# Altium project Stm32l433rct6 Geliştirme Kartı.PrjPcb
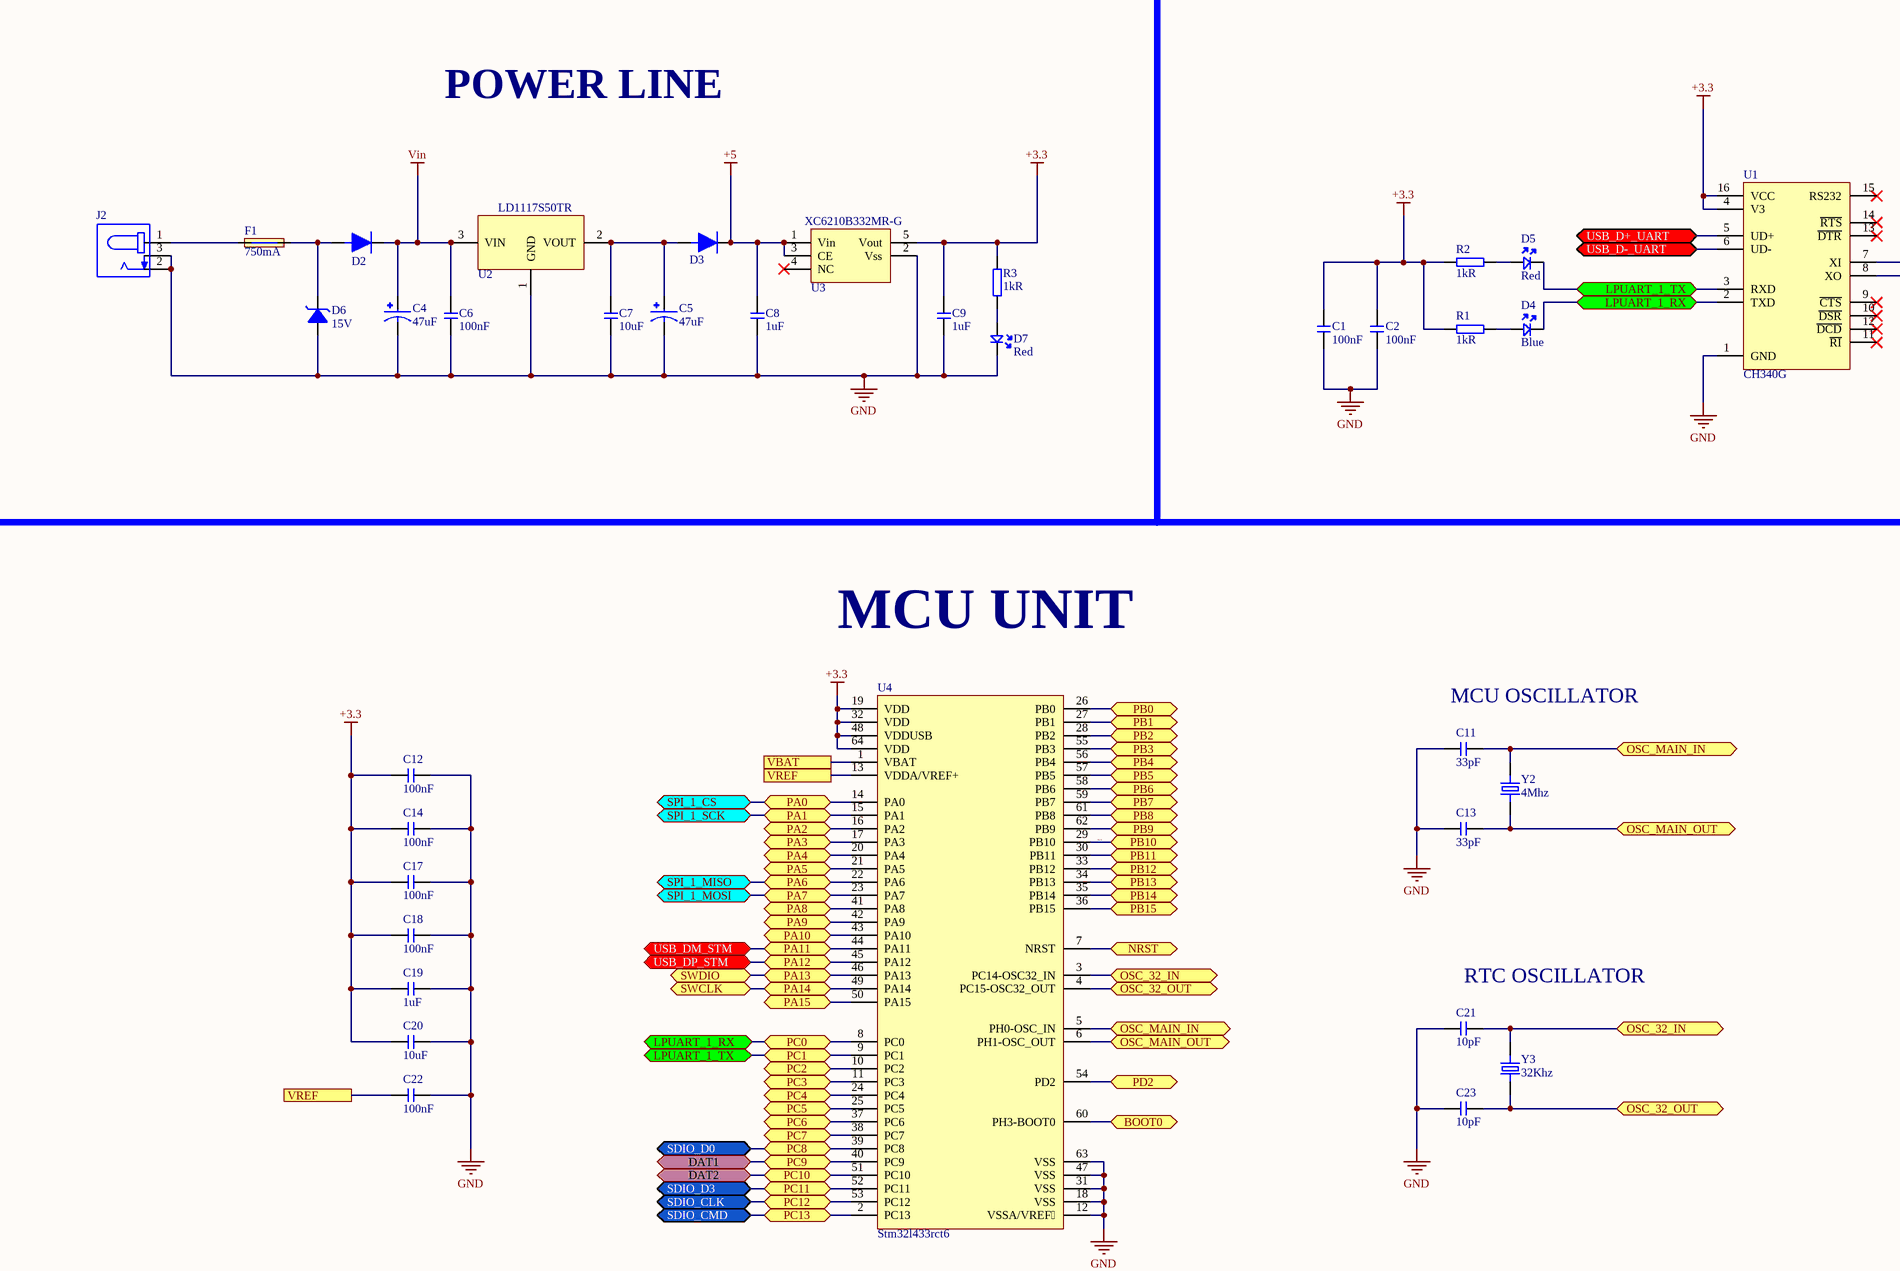
[diagram p0: All_Components.SchDoc, top left]
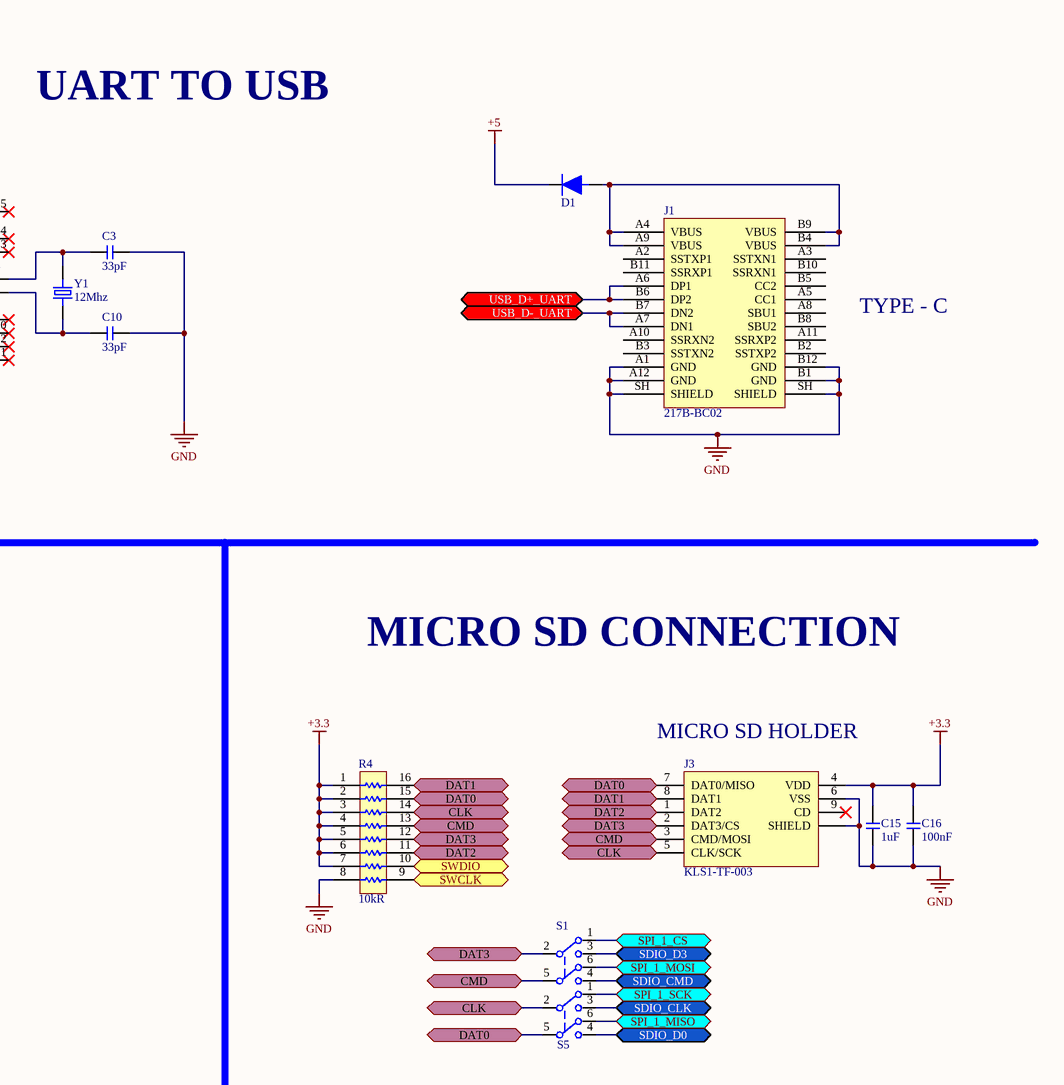
[diagram p1: All_Components.SchDoc, top right]
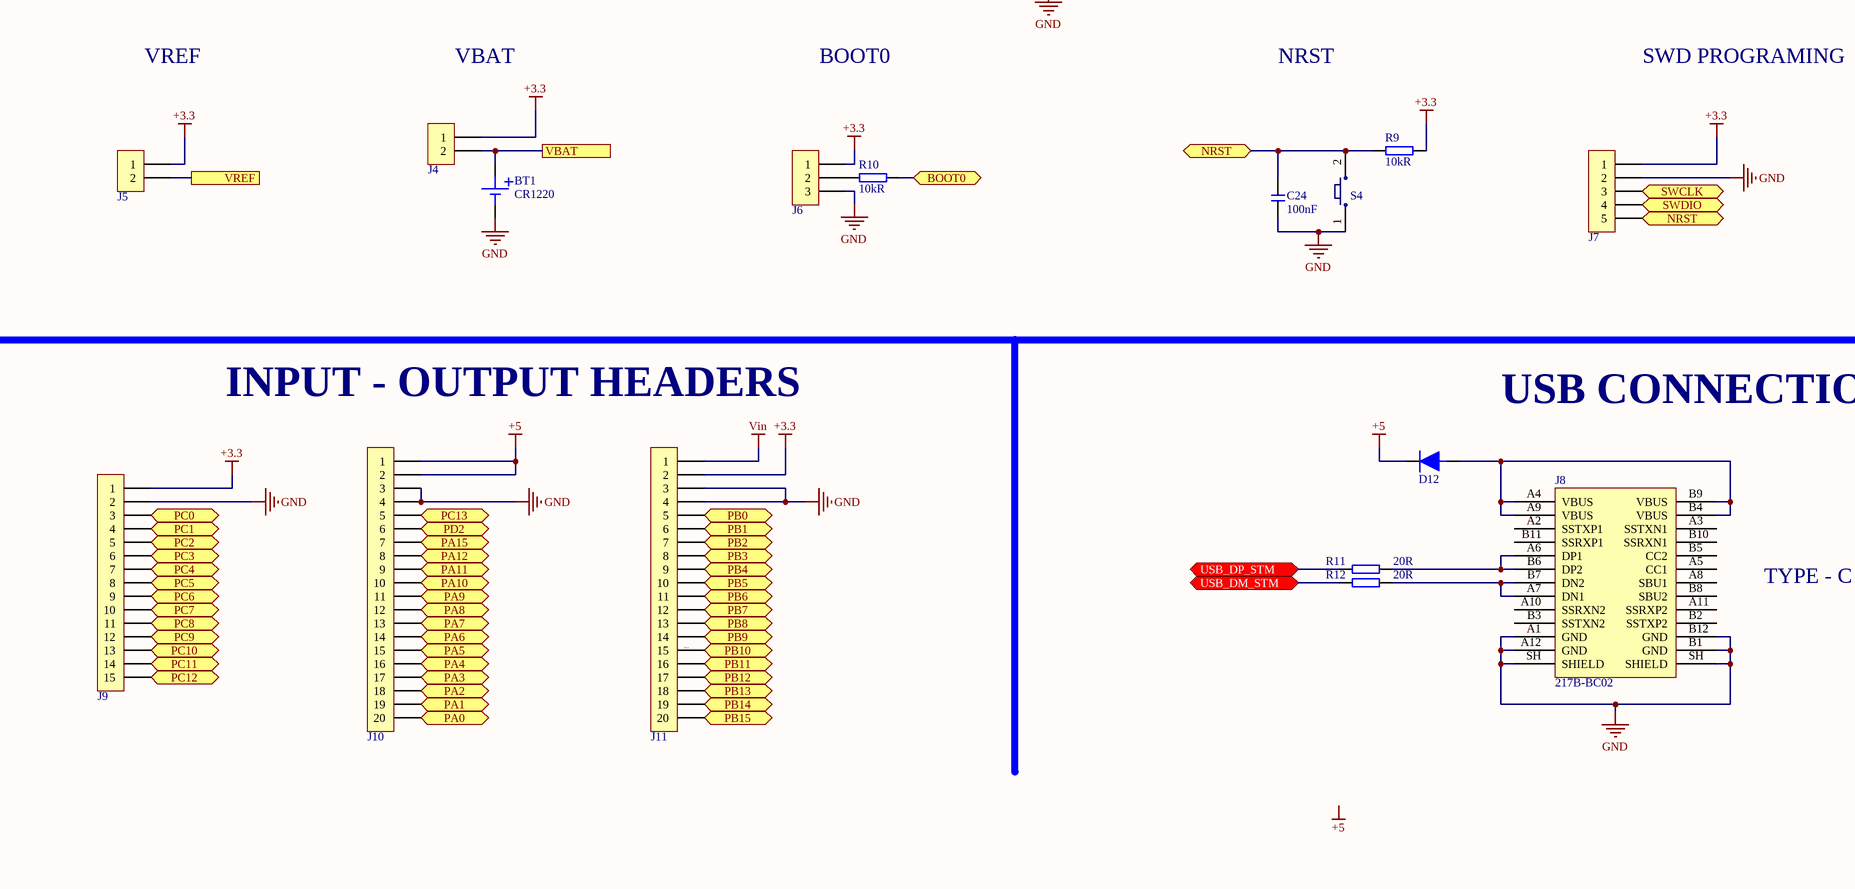
[diagram p2: All_Components.SchDoc, bottom left]
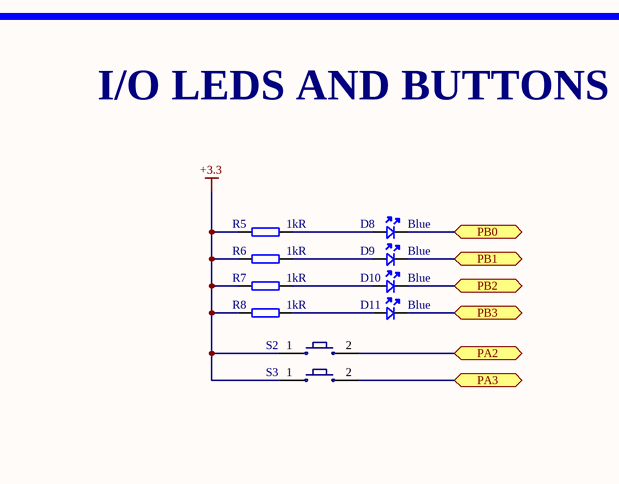
[diagram p3: All_Components.SchDoc, bottom right]
1 sheet, 73 parts. Net scope: global (net labels, ports and power ports of the same name join across sheets).
Board file: MyPCB.PcbDoc

## Sheet All_Components.SchDoc
size A2; Engineer: Yunus AYBERGÜLER; SheetNumber: 1; SheetTotal: 1; ENG_APP_DATE: --/--/--; DSN_APP_DATE: --/--/--; CHK_APP_DATE: --/--/--

### Parts
BT1  Package: CR1220  [BATTERY HOLDER CR1220]  (hidden comment: L-KLS5-CR1220-011-R)
C1  Capaticance: 100nF  [CAP 0603]  (hidden comment: CC0603JRX7R9BB104)
C2  Capaticance: 100nF  [CAP 0603]  (hidden comment: CC0603JRX7R9BB104)
C3  Capaticance: 33pF  [CAP 0603]  (hidden comment: CC0603JRNPO9BN330)
C4  Capaticance: 47uF  [SMD,D4xL5.8mm]  (hidden comment: EEEFK1C470SR)
C5  Capaticance: 47uF  [SMD,D4xL5.8mm]  (hidden comment: EEEFK1C470SR)
C6  Capaticance: 100nF  [CAP 0603]  (hidden comment: CC0603JRX7R9BB104)
C7  Capaticance: 10uF  [CAP 0603]  (hidden comment: CL10A106KO8NQNC)
C8  Capaticance: 1uF  [CAP 0603]  (hidden comment: CL10A105KA8NNNC)
C9  Capaticance: 1uF  [CAP 0603]  (hidden comment: CL10A105KA8NNNC)
C10  Capaticance: 33pF  [CAP 0603]  (hidden comment: CC0603JRNPO9BN330)
C11  Capaticance: 33pF  [CAP 0603]  (hidden comment: CC0603JRNPO9BN330)
C12  Capaticance: 100nF  [CAP 0603]  (hidden comment: CC0603JRX7R9BB104)
C13  Capaticance: 33pF  [CAP 0603]  (hidden comment: CC0603JRNPO9BN330)
C14  Capaticance: 100nF  [CAP 0603]  (hidden comment: CC0603JRX7R9BB104)
C15  Capaticance: 1uF  [CAP 0603]  (hidden comment: CL10A105KA8NNNC)
C16  Capaticance: 100nF  [CAP 0603]  (hidden comment: CC0603JRX7R9BB104)
C17  Capaticance: 100nF  [CAP 0603]  (hidden comment: CC0603JRX7R9BB104)
C18  Capaticance: 100nF  [CAP 0603]  (hidden comment: CC0603JRX7R9BB104)
C19  Capaticance: 1uF  [CAP 0603]  (hidden comment: CL10A105KA8NNNC)
C20  Capaticance: 10uF  [CAP 0603]  (hidden comment: CL10A106KO8NQNC)
C21  Capaticance: 10pF  [CAP 0603]  (hidden comment: CC0603FRNPO9BN100)
C22  Capaticance: 100nF  [CAP 0603]  (hidden comment: CC0603JRX7R9BB104)
C23  Capaticance: 10pF  [CAP 0603]  (hidden comment: CC0603FRNPO9BN100)
C24  Capaticance: 100nF  [CAP 0603]  (hidden comment: CC0603JRX7R9BB104)
D1  1N5819HW-7-F  [SOD-123]  (value not drawn)
D2  1N5819HW-7-F  [SOD-123]  (value not drawn)
D3  1N5819HW-7-F  [SOD-123]  (value not drawn)
D4  Color: Blue  [LED_0603]  (hidden comment: NCD0603B1)
D5  Color: Red  [LED_0603]  (hidden comment: NCD0603R1)
D6  Voltage: 15V  [DO214AC (SMA)]  (hidden comment: SMAJ15A)
D7  Color: Red  [LED_0603]  (hidden comment: NCD0603R1)
D8  Color: Blue  [LED_0603]  (hidden comment: NCD0603B1)
D9  Color: Blue  [LED_0603]  (hidden comment: NCD0603B1)
D10  Color: Blue  [LED_0603]  (hidden comment: NCD0603B1)
D11  Color: Blue  [LED_0603]  (hidden comment: NCD0603B1)
D12  1N5819HW-7-F  [SOD-123]  (value not drawn)
F1  Current: 750mA  [PTC_1812]  (hidden comment: FSMD075-33R)
J1  217B-BC02  [USB TYPE C]
J2  L-KLS1-TDC-001-2.0-T  [POWER JACK SMD]  (value not drawn)
J3  KLS1-TF-003  [Micro_SD_Card]
J4  Header_Male_2_PIN(1X2)  [HEADER_MALE_2_PIN(1X2)]  (value not drawn)
J5  Header_Male_2_PIN(1X2)  [HEADER_MALE_2_PIN(1X2)]  (value not drawn)
J6  Header_Male_3_PIN(1X3)  [HEADER_MALE_3_PIN(1X3)]  (value not drawn)
J7  Header_Male_5_PIN(1X5)  [HEADER_MALE_5_PIN(1X5)]  (value not drawn)
J8  217B-BC02  [USB TYPE C]
J9  Header_Female_15_PIN(1X15)  [HEADER_FEMALE_15_PIN(1X15)]  (value not drawn)
J10  Header_Female_20_PIN(1X20)  [HEADER_FEMALE_20_PIN(1X20)]  (value not drawn)
J11  Header_Female_20_PIN(1X20)  [HEADER_FEMALE_20_PIN(1X20)]  (value not drawn)
R1  Resistance: 1kR  [RES 0603]  (hidden comment: AC0603FR-071KL)
R2  Resistance: 1kR  [RES 0603]  (hidden comment: AC0603FR-071KL)
R3  Resistance: 1kR  [RES 0603]  (hidden comment: AC0603FR-071KL)
R4  Resistance: 10kR  [Res Array 16p8]  (hidden comment: 16P8WGJ0103T4E)
R5  Resistance: 1kR  [RES 0603]  (hidden comment: AC0603FR-071KL)
R6  Resistance: 1kR  [RES 0603]  (hidden comment: AC0603FR-071KL)
R7  Resistance: 1kR  [RES 0603]  (hidden comment: AC0603FR-071KL)
R8  Resistance: 1kR  [RES 0603]  (hidden comment: AC0603FR-071KL)
R9  Resistance: 10kR  [RES 0603]  (hidden comment: RC0603FR-0710KL)
R10  Resistance: 10kR  [RES 0603]  (hidden comment: RC0603FR-0710KL)
R11  Resistance: 20R  [RES 0603]  (hidden comment: RC0603FR-0720RL)
R12  Resistance: 20R  [RES 0603]  (hidden comment: RC0603FR-0720RL)
S1  JS202011JCQN  [Switch Slide DPDT]  (value not drawn)
S2  DTSM-61S-V-T/R  [SWITCH TACT 6.00x6.00 4.30mm]  (value not drawn)
S3  DTSM-61S-V-T/R  [SWITCH TACT 6.00x6.00 4.30mm]  (value not drawn)
S4  DTSM-61S-V-T/R  [SWITCH TACT 6.00x6.00 4.30mm]  (value not drawn)
S5  JS202011JCQN  [Switch Slide DPDT]  (value not drawn)
U1  CH340G  [SOIC16N]
U2  LD1117S50TR  [SOT-223]
U3  XC6210B332MR-G  [SOT-25]
U4  Stm32l433rct6  [LQFP 64 - (10 x 10)]
Y1  Frequency: 12Mhz  [HC-49S-SMD]  (hidden comment: AS-12.000-18-SMD-TR)
Y2  Frequency: 4Mhz  [HC-49S-SMD]  (hidden comment: AS-4.000-16-SMD-TR)
Y3  Frequency: 32Khz  [SMD3215-2P]  (hidden comment: RT3215-32.768-6-EXT-TR)

### Ports
BOOT0 (bidir, see All_Components[3C]), BOOT0 (bidir, see All_Components[4C]), CLK (bidir, see All_Components[7B]), CMD (bidir, see All_Components[7B]), DAT0 (bidir, see All_Components[7B]), DAT0 (bidir, see All_Components[7B], All_Components[7C]), DAT1 (bidir, see All_Components[2C], All_Components[7B]), DAT1 (bidir, see All_Components[7B]), DAT2 (bidir, see All_Components[2C], All_Components[7B]), DAT2 (bidir, see All_Components[7B]), DAT3 (bidir, see All_Components[7B]), LPUART_1_RX (bidir, see All_Components[2C]), LPUART_1_RX (bidir, see All_Components[5A]), LPUART_1_TX (bidir, see All_Components[2C]), LPUART_1_TX (bidir, see All_Components[5A]), NRST (bidir, see All_Components[4B], All_Components[4C]), NRST (bidir, see All_Components[4B], All_Components[5C]), NRST (bidir, see All_Components[4C], All_Components[5C]), OSC_32_IN (bidir, see All_Components[4B]), OSC_32_IN (bidir, see All_Components[5C]), OSC_32_OUT (bidir, see All_Components[4B]), OSC_32_OUT (bidir, see All_Components[5C]), OSC_MAIN_IN (bidir, see All_Components[4C]), OSC_MAIN_IN (bidir, see All_Components[5B]), OSC_MAIN_OUT (bidir, see All_Components[4C]), OSC_MAIN_OUT (bidir, see All_Components[5B]), PA0 (bidir, see All_Components[2D]), PA0 (bidir, see All_Components[3B]), PA1 (bidir, see All_Components[2D]), PA1 (bidir, see All_Components[3B]), PA2 (bidir, see All_Components[2D], All_Components[3B]), PA2 (bidir, see All_Components[2D], All_Components[8C]), PA2 (bidir, see All_Components[3B], All_Components[8C]), PA3 (bidir, see All_Components[2D], All_Components[3B]), PA3 (bidir, see All_Components[2D], All_Components[8C]), PA3 (bidir, see All_Components[3B], All_Components[8C]), PA4 (bidir, see All_Components[2D]), PA4 (bidir, see All_Components[3B]), PA5 (bidir, see All_Components[2D]), PA5 (bidir, see All_Components[3B]), PA6 (bidir, see All_Components[2D]), PA6 (bidir, see All_Components[3B]), PA7 (bidir, see All_Components[2D]), PA7 (bidir, see All_Components[3B]), PA8 (bidir, see All_Components[2D]), PA8 (bidir, see All_Components[3B]), PA9 (bidir, see All_Components[2D]), PA9 (bidir, see All_Components[3B]), PA10 (bidir, see All_Components[2D]), PA10 (bidir, see All_Components[3B]), PA11 (bidir, see All_Components[2D]), PA11 (bidir, see All_Components[3B]), PA12 (bidir, see All_Components[2D]), PA12 (bidir, see All_Components[3B]), PA13 (bidir), PA14 (bidir), PA15 (bidir, see All_Components[2D]), PA15 (bidir, see All_Components[3C]), PB0 (bidir, see All_Components[3D], All_Components[4B]), PB0 (bidir, see All_Components[3D], All_Components[8C]), PB0 (bidir, see All_Components[4B], All_Components[8C]), PB1 (bidir, see All_Components[3D], All_Components[4B]), PB1 (bidir, see All_Components[3D], All_Components[8C]), PB1 (bidir, see All_Components[4B], All_Components[8C]), PB2 (bidir, see All_Components[3D], All_Components[4B]), PB2 (bidir, see All_Components[3D], All_Components[8C]), PB2 (bidir, see All_Components[4B], All_Components[8C]), PB3 (bidir, see All_Components[3D], All_Components[4B]), PB3 (bidir, see All_Components[3D], All_Components[8C]), PB3 (bidir, see All_Components[4B], All_Components[8C]), PB4 (bidir, see All_Components[3D]), PB4 (bidir, see All_Components[4B]), PB5 (bidir, see All_Components[3D]), PB5 (bidir, see All_Components[4B]), PB6 (bidir, see All_Components[3D]), PB6 (bidir, see All_Components[4B]), PB7 (bidir, see All_Components[3D]), PB7 (bidir, see All_Components[4B]), PB8 (bidir, see All_Components[3D]), PB8 (bidir, see All_Components[4B]), PB9 (bidir, see All_Components[3D]), PB9 (bidir, see All_Components[4B]), PB10 (bidir, see All_Components[3D]), PB10 (bidir, see All_Components[4B]), PB11 (bidir, see All_Components[3D]), PB11 (bidir, see All_Components[4B]), PB12 (bidir, see All_Components[3D]), PB12 (bidir, see All_Components[4B]), PB13 (bidir, see All_Components[3D]), PB13 (bidir, see All_Components[4B]), PB14 (bidir, see All_Components[3D]), PB14 (bidir, see All_Components[4B]), PB15 (bidir, see All_Components[3D]), PB15 (bidir, see All_Components[4B]), PC0 (bidir, see All_Components[1D]), PC0 (bidir, see All_Components[3C]), PC1 (bidir, see All_Components[1D]), PC1 (bidir, see All_Components[3C]), PC2 (bidir, see All_Components[1D]), PC2 (bidir, see All_Components[3C]), PC3 (bidir, see All_Components[1D]), PC3 (bidir, see All_Components[3C]), PC4 (bidir, see All_Components[1D]), PC4 (bidir, see All_Components[3C]), PC5 (bidir, see All_Components[1D]), PC5 (bidir, see All_Components[3C]), PC6 (bidir, see All_Components[1D]), PC6 (bidir, see All_Components[3C]), PC7 (bidir, see All_Components[1D]), PC7 (bidir, see All_Components[3C]), PC8 (bidir, see All_Components[1D]), PC8 (bidir, see All_Components[3C]), PC9 (bidir, see All_Components[1D]), PC9 (bidir, see All_Components[3C]), PC10 (bidir, see All_Components[1D]), PC10 (bidir, see All_Components[3C]), PC11 (bidir, see All_Components[1D]), PC11 (bidir, see All_Components[3C]), PC12 (bidir, see All_Components[1D]), PC12 (bidir, see All_Components[3C]), PC13 (bidir, see All_Components[2D]), PC13 (bidir, see All_Components[3C]), PD2 (bidir, see All_Components[2D]), PD2 (bidir, see All_Components[4C]), SDIO_CLK (bidir, see All_Components[2C]), SDIO_CLK (bidir, see All_Components[7B]), SDIO_CMD (bidir, see All_Components[2C]), SDIO_CMD (bidir, see All_Components[7B]), SDIO_D0 (bidir, see All_Components[2C]), SDIO_D0 (bidir, see All_Components[7C]), SDIO_D3 (bidir, see All_Components[2C]), SDIO_D3 (bidir, see All_Components[7B]), SPI_1_CS (bidir, see All_Components[2B]), SPI_1_CS (bidir, see All_Components[7B]), SPI_1_MISO (bidir, see All_Components[2B]), SPI_1_MISO (bidir, see All_Components[7C]), SPI_1_MOSI (bidir, see All_Components[2B]), SPI_1_MOSI (bidir, see All_Components[7B]), SPI_1_SCK (bidir, see All_Components[2B]), SPI_1_SCK (bidir, see All_Components[7B]), SWCLK (bidir, see All_Components[2B], All_Components[5C]), SWCLK (bidir, see All_Components[2B], All_Components[7B]), SWCLK (bidir, see All_Components[5C], All_Components[7B]), SWDIO (bidir, see All_Components[2B], All_Components[5C]), SWDIO (bidir, see All_Components[2B], All_Components[7B]), SWDIO (bidir, see All_Components[5C], All_Components[7B]), USB_D+_UART (bidir, see All_Components[5A]), USB_D+_UART (bidir, see All_Components[7A]), USB_D-_UART (bidir, see All_Components[5A]), USB_D-_UART (bidir, see All_Components[7A]), USB_DM_STM (bidir, see All_Components[2B]), USB_DM_STM (bidir, see All_Components[4D]), USB_DP_STM (bidir, see All_Components[2B]), USB_DP_STM (bidir, see All_Components[4D]), VBAT (see All_Components[2C]), VBAT (see All_Components[3B]), VREF (see All_Components[1C]), VREF (see All_Components[1C], All_Components[3B])

### Nets
+3.3: C1.2 C2.2 C9.2 C12.1 C14.1 C15.2 C16.2 C17.1 C18.1 C19.1 C20.1 J3.4(VDD) J4.1 J5.1 J6.1 J7.1 J9.1 J11.2 R1.2 R2.2 R3.2 R4.1 R4.2 R4.3 R4.4 R4.5 R4.6 R4.7 R5.1 R6.1 R7.1 R8.1 R9.2 S2.1 S3.1 U1.4(V3) U1.16(VCC) U3.5(Vout) U4.19(VDD) U4.32(VDD) U4.48(VDDUSB) U4.64(VDD)
+5: C8.2 D1.C(CA) D3.C(CA) D12.C(CA) J10.1 J10.2 U3.1(Vin) U3.3(CE)
GND: BT1.N C1.1 C2.1 C3.2 C4.2 C5.2 C6.1 C7.1 C8.1 C9.1 C10.2 C11.1 C12.2 C13.1 C14.2 C15.1 C16.1 C17.2 C18.2 C19.2 C20.2 C21.1 C22.2 C23.1 C24.1 D6.1(A) D7.C J1.A1(GND) J1.A12(GND) J1.B1(GND) J1.B12(GND) J1.SH(SHIELD) J2.2 J2.3 J3.6(VSS) J3.SH(SHIELD) J6.3 J7.2 J8.A1(GND) J8.A12(GND) J8.B1(GND) J8.B12(GND) J8.SH(SHIELD) J9.2 J10.3 J10.4 J11.3 J11.4 R4.8 S4.1 U1.1(GND) U2.1(GND) U3.2(Vss) U4.12(VSSA/VREF) U4.18(VSS) U4.31(VSS) U4.47(VSS) U4.63(VSS)
Vin: C4.1 C6.2 D2.C(CA) J11.1 U2.3(VIN)
PB10: J11.15 U4.29(PB10) ; port PB10
NetBT1_P: BT1.P J4.2 U4.1(VBAT) ; port VBAT
NetC3_1: C3.1 U1.7(XI) Y1.2
NetC5_1: C5.1 C7.2 D3.A(AN) U2.2(VOUT)
NetC10_1: C10.1 U1.8(XO) Y1.1
NetC11_2: C11.2 U4.5(PH0-OSC_IN) Y2.2 ; port OSC_MAIN_IN
NetC13_2: C13.2 U4.6(PH1-OSC_OUT) Y2.1 ; port OSC_MAIN_OUT
NetC21_2: C21.2 U4.3(PC14-OSC32_IN) Y3.2 ; port OSC_32_IN
NetC22_1: C22.1 J5.2 U4.13(VDDA/VREF+) ; port VREF
NetC23_2: C23.2 U4.4(PC15-OSC32_OUT) Y3.1 ; port OSC_32_OUT
NetC24_2: C24.2 J7.5 R9.1 S4.2 U4.7(NRST) ; port NRST
NetD1_A: D1.A(AN) J1.A4(VBUS) J1.A9(VBUS) J1.B4(VBUS) J1.B9(VBUS)
NetD2_A: D2.A(AN) D6.2(K) F1.2
NetD4_A: D4.A R1.1
NetD4_C: D4.C J9.3 U1.2(TXD) U4.8(PC0) ; port PC0, port LPUART_1_RX
NetD5_A: D5.A R2.1
NetD5_C: D5.C J9.4 U1.3(RXD) U4.9(PC1) ; port PC1, port LPUART_1_TX
NetD7_A: D7.A R3.1
NetD8_A: D8.A R5.2
NetD8_C: D8.C J11.5 U4.26(PB0) ; port PB0
NetD9_A: D9.A R6.2
NetD9_C: D9.C J11.6 U4.27(PB1) ; port PB1
NetD10_A: D10.A R7.2
NetD10_C: D10.C J11.7 U4.28(PB2) ; port PB2
NetD11_A: D11.A R8.2
NetD11_C: D11.C J11.8 U4.55(PB3) ; port PB3
NetD12_A: D12.A(AN) J8.A4(VBUS) J8.A9(VBUS) J8.B4(VBUS) J8.B9(VBUS)
NetF1_1: F1.1 J2.1
NetJ1_A6: J1.A6(DP1) J1.B6(DP2) U1.5(UD+) ; port USB_D+_UART
NetJ1_A7: J1.A7(DN1) J1.B7(DN2) U1.6(UD-) ; port USB_D-_UART
NetJ3_1: J3.1(DAT2) J9.13 R4.11 U4.51(PC10) ; port PC10, port DAT2
NetJ3_2: J3.2(DAT3/CS) R4.12 S1.2 ; port DAT3
NetJ3_3: J3.3(CMD/MOSI) R4.13 S1.5 ; port CMD
NetJ3_5: J3.5(CLK/SCK) R4.14 S5.2 ; port CLK
NetJ3_7: J3.7(DAT0/MISO) R4.15 S5.5 ; port DAT0
NetJ3_8: J3.8(DAT1) J9.12 R4.16 U4.40(PC9) ; port PC9, port DAT1
NetJ6_2: J6.2 R10.1
NetJ7_3: J7.3 R4.9 U4.49(PA14) ; port PA14, port SWCLK
NetJ7_4: J7.4 R4.10 U4.46(PA13) ; port PA13, port SWDIO
NetJ8_A6: J8.A6(DP1) J8.B6(DP2) R11.2
NetJ8_A7: J8.A7(DN1) J8.B7(DN2) R12.2
NetJ9_5: J9.5 U4.10(PC2) ; port PC2
NetJ9_6: J9.6 U4.11(PC3) ; port PC3
NetJ9_7: J9.7 U4.24(PC4) ; port PC4
NetJ9_8: J9.8 U4.25(PC5) ; port PC5
NetJ9_9: J9.9 U4.37(PC6) ; port PC6
NetJ9_10: J9.10 U4.38(PC7) ; port PC7
NetJ9_11: J9.11 S5.4 U4.39(PC8) ; port PC8, port SDIO_D0
NetJ9_14: J9.14 S1.3 U4.52(PC11) ; port PC11, port SDIO_D3
NetJ9_15: J9.15 S5.3 U4.53(PC12) ; port PC12, port SDIO_CLK
NetJ10_5: J10.5 S1.4 U4.2(PC13) ; port PC13, port SDIO_CMD
NetJ10_6: J10.6 U4.54(PD2) ; port PD2
NetJ10_7: J10.7 U4.50(PA15) ; port PA15
NetJ10_8: J10.8 R11.1 U4.45(PA12) ; port PA12, port USB_DP_STM
NetJ10_9: J10.9 R12.1 U4.44(PA11) ; port PA11, port USB_DM_STM
NetJ10_10: J10.10 U4.43(PA10) ; port PA10
NetJ10_11: J10.11 U4.42(PA9) ; port PA9
NetJ10_12: J10.12 U4.41(PA8) ; port PA8
NetJ10_13: J10.13 S1.6 U4.23(PA7) ; port PA7, port SPI_1_MOSI
NetJ10_14: J10.14 S5.6 U4.22(PA6) ; port PA6, port SPI_1_MISO
NetJ10_15: J10.15 U4.21(PA5) ; port PA5
NetJ10_16: J10.16 U4.20(PA4) ; port PA4
NetJ10_17: J10.17 S3.2 U4.17(PA3) ; port PA3
NetJ10_18: J10.18 S2.2 U4.16(PA2) ; port PA2
NetJ10_19: J10.19 S5.1 U4.15(PA1) ; port PA1, port SPI_1_SCK
NetJ10_20: J10.20 S1.1 U4.14(PA0) ; port PA0, port SPI_1_CS
NetJ11_9: J11.9 U4.56(PB4) ; port PB4
NetJ11_10: J11.10 U4.57(PB5) ; port PB5
NetJ11_11: J11.11 U4.58(PB6) ; port PB6
NetJ11_12: J11.12 U4.59(PB7) ; port PB7
NetJ11_13: J11.13 U4.61(PB8) ; port PB8
NetJ11_14: J11.14 U4.62(PB9) ; port PB9
NetJ11_16: J11.16 U4.30(PB11) ; port PB11
NetJ11_17: J11.17 U4.33(PB12) ; port PB12
NetJ11_18: J11.18 U4.34(PB13) ; port PB13
NetJ11_19: J11.19 U4.35(PB14) ; port PB14
NetJ11_20: J11.20 U4.36(PB15) ; port PB15
NetR10_2: R10.2 U4.60(PH3-BOOT0) ; port BOOT0

Not connected (* = marked no-connect by the designer): J1 A2(SSTXP1) A3(SSTXN1) A5(CC1) A8(SBU1) A10(SSRXN2) A11(SSRXP2) B2(SSTXP2) B3(SSTXN2) B5(CC2) B8(SBU2) B10(SSRXN1) B11(SSRXP1); J3 9(CD)*; J8 A2(SSTXP1) A3(SSTXN1) A5(CC1) A8(SBU1) A10(SSRXN2) A11(SSRXP2) B2(SSTXP2) B3(SSTXN2) B5(CC2) B8(SBU2) B10(SSRXN1) B11(SSRXP1); U1 9(~{CTS})* 10(~{DSR})* 11(~{RI})* 12(~{DCD})* 13(~{DTR})* 14(~{RTS})* 15(RS232)*; U3 4(NC)*

### Notes on the sheet
- POWER LINE
- UART TO USB
- TYPE - C
- MCU UNIT
- MICRO SD CONNECTION
- (near C11) MCU OSCILLATOR
- (near J3) MICRO SD HOLDER
- (near C21) RTC OSCILLATOR
- I/O LEDS AND BUTTONS
- VREF
- VBAT
- BOOT0
- NRST
- SWD PROGRAMING
- INPUT - OUTPUT HEADERS
- USB CONNECTION
- Labels drawn without touching a wire or pin: +5, PB10
- Project
- Company
- Size:
- Engineer:
- File:
- A3
- Sheets
- of
- Date:
- Revision:

### Library data of the parts
BT1 = BATTERY HOLDER CR1220_1: BATTERY HOLDER SMD FOR CR1220 METAL BULK; ComponentLink1Description: https://ozdisan.com/bataryalar/batarya-aksesuarlari/pil-yuvalari/L-KLS5-CR1220-011-R/585223; ComponentLink1URL: https://ozdisan.com/bataryalar/batarya-aksesuarlari/pil-yuvalari/L-KLS5-CR1220-011-R/585223
C1 C2 C6 C12 C14 C16-C18 C22 C24 = CAP CER 100nF 0603: 50V 100nF X7R ±5% 0603 Multilayer Ceramic Capacitors
C3 C10 C11 C13 = CAP CER 33pF 0603: 50V 33pF NP0 ±5% 0603 Multilayer Ceramic Capacitors
C4 C5 = CAP ALUM 47uF: 47uF 5.8mm 16V 4mm ±20% SMD,4x5.8mm Aluminum Electrolytic Capacitors
C7 C20 = CAP CER 10uF 0603: 16V 10uF X5R ±10% 0603 Multilayer Ceramic Capacitors
C8 C9 C15 C19 = CAP CER 1uF 0603: 25V 1uF X5R ±10% 0603 Multilayer Ceramic Capacitors
C21 C23 = CAP CER 10pF 0603: 50V 10pF NP0 ±1% 0603 Multilayer Ceramic Capacitors
D1-D3 D12 = Diode Shottky: DIODE SCHOTTKY 1A 40V SOD123; ComponentLink1Description: https://ozdisan.com/Product/Detail/417246/1N5819HW-7-F; ComponentLink1URL: https://ozdisan.com/Product/Detail/417246/1N5819HW-7-F; Manufacturer Part Number: 1N5819HW-7-F
D4 D8-D11 = Led Blue 0603: Blue 130° 65mW 0603 Light Emitting Diodes (LED)
D5 D7 = Led Red 0603: Red 130° 65mW 0603 Light Emitting Diodes (LED)
D6 = Diode TVS 15V: 24.4V 16.7V 15V SMA(DO-214AC)  TVS ROHS; ComponentLink1Description: https://ozdisan.com/guc-yari-iletkenleri/diyotlar-modul-diyotlar-ve-dogrultucular/tvs-diyotlar/P4SMAJ15ASR100001/642899; ComponentLink1URL: https://ozdisan.com/guc-yari-iletkenleri/diyotlar-modul-diyotlar-ve-dogrultucular/tvs-diyotlar/P4SMAJ15ASR100001/642899; Manufacturer Part Number: SMAJ15A
F1 = PTC Fuse 1812: THERMISTOR PTC RESETTABLE FUSE 1812 750mA 33V; ComponentLink1Description: https://ozdisan.com/devre-koruyucular/sigorta-bilesenleri/ptc-sigortalar/FSMD075-33R/537034; ComponentLink1URL: https://ozdisan.com/devre-koruyucular/sigorta-bilesenleri/ptc-sigortalar/FSMD075-33R/537034; Manufacturer Part Number: FSMD075-33R
J1 J8 = Usb Type C 3.1: CONN.USB 3.1 C TYPE SMT R/A DUAL ROW; Manufacturer Part Number: 1054500101; ComponentLink1Description: https://ozdisan.com/konnektor-ve-baglanti-elemanlari/usb-dvi-hdmi-konnektorler/usb-konnektorler/217B-BC02/607751; ComponentLink1URL: https://ozdisan.com/konnektor-ve-baglanti-elemanlari/usb-dvi-hdmi-konnektorler/usb-konnektorler/217B-BC02/607751
J2 = Power Receptacle 2mm Smd_1: CONNECTOR JACK DC POWER 2MM SMD; ComponentLink1Description: https://ozdisan.com/konnektor-ve-baglanti-elemanlari/power-konnektorler/power-jackler/L-KLS1-TDC-001-2-0-T/466366; ComponentLink1URL: https://ozdisan.com/konnektor-ve-baglanti-elemanlari/power-konnektorler/power-jackler/L-KLS1-TDC-001-2-0-T/466366
J3 = Micro SD Card_1: -25℃~+85℃ 1.8mm Tin Deck MicroSD card (TF card) 260℃ C5191 Self bomb SMD  SD Card Connectors ROHS; Manufacturer Part Number: TF-115-BCP9; ComponentLink1Description: https://www.ozdisan.com/p/pc-kart-soketleri-10181?SearchText=KLS1-TF-003; ComponentLink1URL: https://www.ozdisan.com/p/pc-kart-soketleri-10181?SearchText=KLS1-TF-003
J4 J5 = Header_Male_2_PIN(1X2): PIN HEADER 2PIN(1x2) 2.54mm THT V/T
J6 = Header_Male_3_PIN(1X3): PIN HEADER 3PIN(1x3) 2.54mm THT V/T
J7 = Header_Male_5_PIN(1X5): PIN HEADER 5PIN(1x5) 2.54mm THT R/A
J9 = Header_Female_15_PIN(1X15): FEMALE HEADER 10PIN(1x10) 2.54mm THT V/T TRAY
J10 J11 = Header_Female_20_PIN(1X20): FEMALE HEADER 10PIN(1x10) 2.54mm THT V/T TRAY
R1-R3 R5-R8 = RES 1kR 0603: 100mW Thick Film Resistors ±100ppm/℃ ±1% 1kΩ 0603 Chip Resistor
R4 = RES Array 10kR 16P8_1: 8 ±5% 10kΩ 63mW ±200ppm/℃ SMD-16P,1.6x3.8mm  Resistor Networks & Arrays; Manufacturer Part Number: YC248-JR-0710KL; ComponentLink1Description: https://ozdisan.com/pasif-komponentler/direncler/ag-ve-sira-direncler/16P8WGJ0103T4E/474050; ComponentLink1URL: https://ozdisan.com/pasif-komponentler/direncler/ag-ve-sira-direncler/16P8WGJ0103T4E/474050
R9 R10 = RES 10kR 0603: 100mW Thick Film Resistors ±100ppm/℃ ±1% 10kΩ 0603 Chip Resistor
R11 R12 = RES 20R 0603: 100mW Thick Film Resistors ±100ppm/℃ ±1% 20Ω 0603 Chip Resistor
S1 S5 = Switch Slide DPDT SMT: SWITCH SLIDE DPDT 300MA 6V; ComponentLink1Description: https://ozdisan.com/elektromekanik-komponentler/sivicler-ve-anahtarlar/surgulu-sivicler/JS202011JCQN/1022388; ComponentLink1URL: https://ozdisan.com/elektromekanik-komponentler/sivicler-ve-anahtarlar/surgulu-sivicler/JS202011JCQN/1022388
S2-S4 = SWITCH TACT 6.00x6.00 4.30mm_1: -40℃~+85℃ 6mm 5mm Red 50mA Round Button Brick nogging SPST 6mm 12V 250gf@±50gf SMD  Tactile Switches ROHS; Manufacturer Part Number: TPF16LS-SE50 Copy
U1 = CH340G: 2Mbps Transceiver USB 2.0 SOP-16  USB ICs ROHS; ComponentLink1Description: https://www.ozdisan.com/entegre-devreler-icler/interface-entegreleri/arayuz-kontrolor-entegreleri/CH340G/469466; ComponentLink1URL: https://www.ozdisan.com/entegre-devreler-icler/interface-entegreleri/arayuz-kontrolor-entegreleri/CH340G/469466; Manufacturer Part Number: CH340G
U2 = Regulator LDO 5V: 800mA Fixed 5V Positive 15V SOT-223  Linear Voltage Regulators (LDO); ComponentLink1Description: https://ozdisan.com/entegre-devreler-icler/guc-entegreleri/lineer-voltaj-regulatorleri/LD1117S50TR/405969; ComponentLink1URL: https://ozdisan.com/entegre-devreler-icler/guc-entegreleri/lineer-voltaj-regulatorleri/LD1117S50TR/405969; Manufacturer Part Number: LD1117S50TR
U3 = Regulator LDO 3.3V: 700mA 60dB@(1kHz) Fixed 3.3V Positive 6V SOT-25 Linear Voltage; ComponentLink1Description: https://ozdisan.com/entegre-devreler-icler/guc-entegreleri/lineer-voltaj-regulatorleri/XC6210B332MR-G/490658; ComponentLink1URL: https://ozdisan.com/entegre-devreler-icler/guc-entegreleri/lineer-voltaj-regulatorleri/XC6210B332MR-G/490658; Manufacturer Part Number: XC6210B332MR-G
U4 = Stm32l433rct6: Ultra-low-power with FPU ARM Cortex-M4 MCU 80 MHz with 256 Kbytes Flash, LCD, USB; Manufacturer: STMicroelectronics; Supplier: Mouser; Supplier Part Number: 511-STM32L433RCT6; Manufacturer Part Number: STM32L433RCT6; RoHS: Yes; Category: Microcontrollers; Stock: 2539; Pricing: 1=6,86, 10=6,2, 50=5,14, 100=4,91, 1000=3,89, 10000=3,89 (USD); ComponentLink1URL: http://www.farnell.com/datasheets/2581765.pdf?src-supplier=Farnell; ComponentLink1Description: http://www.farnell.com/datasheets/2581765.pdf?src-supplier=Farnell; ComponentLink2URL: http://www.farnell.com/datasheets/2581765.pdf?src-supplier=Element14; ComponentLink2Description: http://www.farnell.com/datasheets/2581765.pdf?src-supplier=Element14; ComponentLink3URL: http://www.farnell.com/datasheets/2581765.pdf?src-supplier=Newark; ComponentLink3Description: http://www.farnell.com/datasheets/2581765.pdf?src-supplier=Newark; ComponentLink4URL: http://www.st.com/content/ccc/resource/technical/document/reference_manual/group0/b0/ac/3e/8f/6d/21/47/af/DM00151940/files/DM00151940.pdf/jcr:content/translations/en.DM00151940.pdf?src-supplier=Digi-Key; ComponentLink4Description: http://www.st.com/content/ccc/resource/technical/document/reference_manual/group0/b0/ac/3e/8f/6d/21/47/af/DM00151940/files/DM00151940.pdf/jcr:content/translations/en.DM00151940.pdf?src-supplier=Digi-Key; ComponentLink5URL: https://datasheet.octopart.com/STM32L433RCT6-STMicroelectronics-datasheet-62336854.pdf?src-supplier=Future+Electronics; ComponentLink5Description: https://datasheet.octopart.com/STM32L433RCT6-STMicroelectronics-datasheet-62336854.pdf?src-supplier=Future+Electronics; ComponentLink6URL: https://datasheet.octopart.com/STM32L433RCT6-STMicroelectronics-datasheet-82526589.pdf?src-supplier=SHENGYU+ELECTRONICS; ComponentLink6Description: https://datasheet.octopart.com/STM32L433RCT6-STMicroelectronics-datasheet-82526589.pdf?src-supplier=SHENGYU+ELECTRONICS; ComponentLink7Description: https://ozdisan.com/Product/Detail/492672/STM32L433RCT6; ComponentLink7URL: https://ozdisan.com/Product/Detail/492672/STM32L433RCT6
Y1 = Crystal 12Mhz_1: CRYSTAL 12.0000MHZ 18PF SMD; Manufacturer Part Number: X49SM12MSD2SC; ComponentLink1Description: https://www.ozdisan.com/pasif-komponentler/kristaller-osilatorler-ve-rezanatorler/kristaller/AS-12-000-18-SMD-TR/642535; ComponentLink1URL: https://www.ozdisan.com/pasif-komponentler/kristaller-osilatorler-ve-rezanatorler/kristaller/AS-12-000-18-SMD-TR/642535
Y2 = Crystal 4Mhz_1: 4MHz 20pF ±20ppm HC-49S-SMD Crystals ROHS; ComponentLink1Description: https://ozdisan.com/pasif-komponentler/kristaller-osilatorler-ve-rezanatorler/kristaller/AS-4-000-16-SMD-TR/40448; ComponentLink1URL: https://ozdisan.com/pasif-komponentler/kristaller-osilatorler-ve-rezanatorler/kristaller/AS-4-000-16-SMD-TR/40448
Y3 = Crystal 32Khz_1: 32.768kHz 6pF ±20ppm SMD3215-2P Crystals ROHS; ComponentLink1Description: https://ozdisan.com/pasif-komponentler/kristaller-osilatorler-ve-rezanatorler/kristaller/RT3215-32-768-6-EXT-TR/576635; ComponentLink1URL: https://ozdisan.com/pasif-komponentler/kristaller-osilatorler-ve-rezanatorler/kristaller/RT3215-32-768-6-EXT-TR/576635